# Altium schematic sheet ANYA_2620_V1_I1.SchDoc
size A2; SheetNumber: 1; SheetTotal: 2
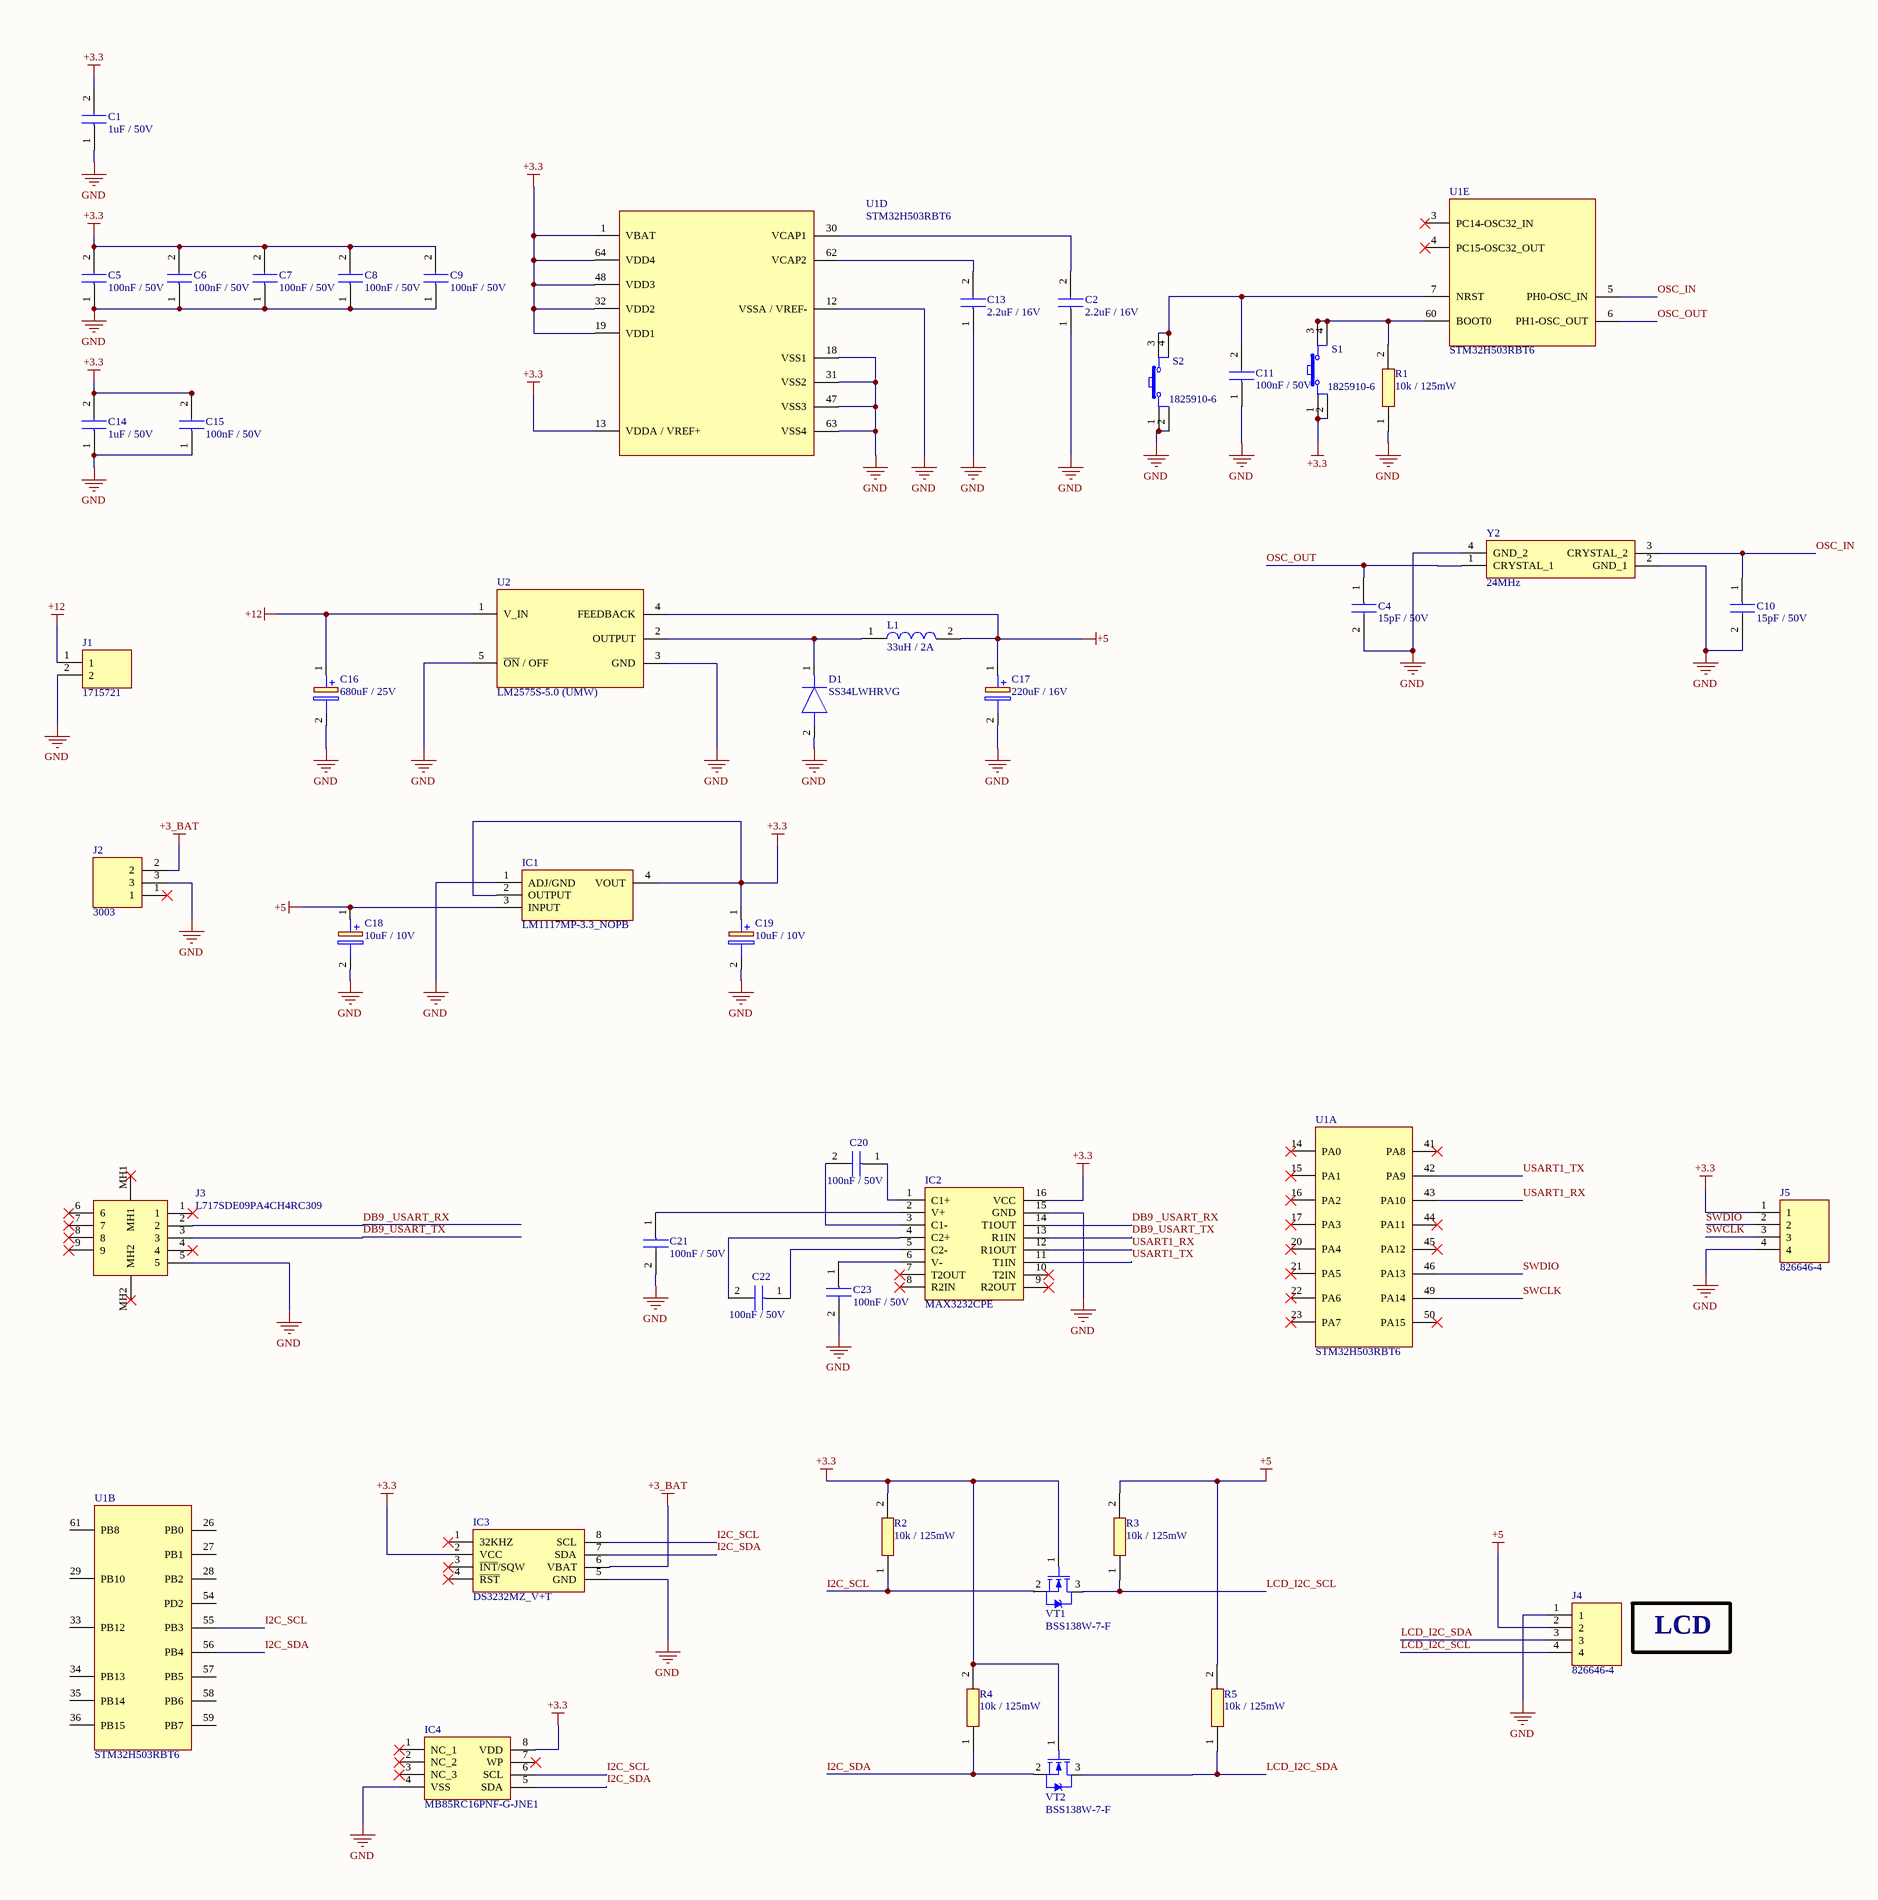
[diagram p0: ANYA_2620_V1_I1.SchDoc, left]
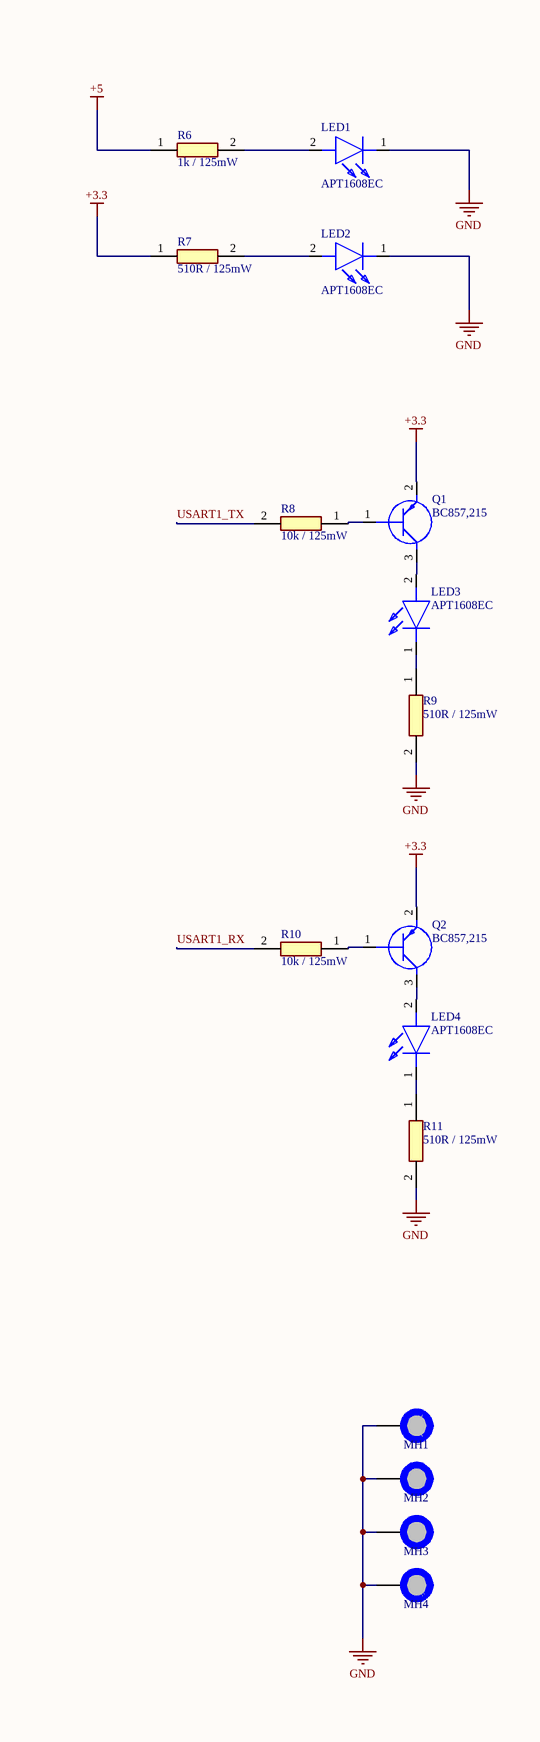
[diagram p1: ANYA_2620_V1_I1.SchDoc, right]

## Parts
C1  1uF / 50V  [CAPC2012X145N]
C2  2.2uF / 16V  [CAPC2012X145N]
C4  15pF / 50V  [CAPC2012X75N]
C5  100nF / 50V  [CAPC2012X95N]
C6  100nF / 50V  [CAPC2012X95N]
C7  100nF / 50V  [CAPC2012X95N]
C8  100nF / 50V  [CAPC2012X95N]
C9  100nF / 50V  [CAPC2012X95N]
C10  15pF / 50V  [CAPC2012X75N]
C11  100nF / 50V  [CAPC2012X95N]
C13  2.2uF / 16V  [CAPC2012X145N]
C14  1uF / 50V  [CAPC2012X145N]
C15  100nF / 50V  [CAPC2012X95N]
C16  680uF / 25V  [CAPPRD500W65D1000H1750]
C17  220uF / 16V  [EEEFK0J331AL]
C18  10uF / 10V  [T491A]
C19  10uF / 10V  [T491A]
C20  100nF / 50V  [CAPC2012X95N]
C21  100nF / 50V  [CAPC2012X95N]
C22  100nF / 50V  [CAPC2012X95N]
C23  100nF / 50V  [CAPC2012X95N]
D1  SS34LWHRVG  [SODFL3718X102N]
D2  LCD  [LCD]  (value not drawn)
IC1  LM1117MP-3.3_NOPB  [SOT230P700X180-4N]
IC2  MAX3232CPE  [DIP794W56P254L1918H457Q16N]
IC3  DS3232MZ_V+T  [SOIC127P600X175-8N]
IC4  MB85RC16PNF-G-JNE1  [SOIC127P600X175-8N]
J1  1715721  [1715721]
J2  3003  [3003]
J3  L717SDE09PA4CH4RC309  [L717SDE09PA4CH4RC309]
J4  826646-4  [HDRV4W68P0X254_1X4_1016X250X880P]
J5  826646-4  [HDRV4W68P0X254_1X4_1016X250X880P]
L1  33uH / 2A  [RLB0912330KL]
LED1  APT1608EC  [LEDC1608X85N]
LED2  APT1608EC  [LEDC1608X85N]
LED3  APT1608EC  [LEDC1608X85N]
LED4  APT1608EC  [LEDC1608X85N]
MH1  MH_7.4MMNC_3.2MMD  [MH_7.4MMD_3.2MMD_NON_COPPER_NPTH]  (value not drawn)  (no BOM)
MH2  MH_7.4MMC_3.2MMD  [MH_7.4MMD_3.2MMD]  (value not drawn)  (no BOM)
MH3  MH_7.4MMC_3.2MMD  [MH_7.4MMD_3.2MMD]  (value not drawn)  (no BOM)
MH4  MH_7.4MMC_3.2MMD  [MH_7.4MMD_3.2MMD]  (value not drawn)  (no BOM)
Q1  BC857,215  [BC857215]
Q2  BC857,215  [BC857215]
R1  10k / 125mW  [RESC2012X60N]
R2  10k / 125mW  [RESC2012X60N]
R3  10k / 125mW  [RESC2012X60N]
R4  10k / 125mW  [RESC2012X60N]
R5  10k / 125mW  [RESC2012X60N]
R6  1k / 125mW  [RESC2013X65N]
R7  510R / 125mW  [ERJ6ENF1000V]
R8  10k / 125mW  [RESC2012X60N]
R9  510R / 125mW  [ERJ6ENF1000V]
R10  10k / 125mW  [RESC2012X60N]
R11  510R / 125mW  [ERJ6ENF1000V]
S1  1825910-6  [TE_1825910-6]
S2  1825910-6  [TE_1825910-6]
U1  STM32H503RBT6  [QFP64P50_1200X1200X160L60X22N]  (parts A,B,D,E of 5)
U2  LM2575S-5.0 (UMW)  [DPAK6P170_1534X467L254X81T736X1018N]
VT1  BSS138W-7-F  [SOT23-3P65_222X100L35X30N]
VT2  BSS138W-7-F  [SOT23-3P65_222X100L35X30N]
Y2  24MHz  [7M24000MEEQT]

## Nets
+3.3: C1.2 C5.2 C6.2 C7.2 C8.2 C9.2 C14.2 C15.2 C19.1(+) IC1.2(OUTPUT) IC1.4(VOUT) IC2.16(VCC) IC3.2(VCC) IC4.8(VDD) J5.1 Q1.2(E) Q2.2(E) R2.2 R4.2 R7.1 S1.1 S1.2 U1.1(VBAT) U1.13(VDDA_/_VREF+) U1.19(VDD1) U1.32(VDD2) U1.48(VDD3) U1.64(VDD4) VT1.1(G) VT2.1(G)
+3_BAT: IC3.6(VBAT) J2.2
+5: C17.1(+) C18.1(+) IC1.3(INPUT) J4.2 L1.2 R3.2 R5.2 R6.1 U2.4(FEEDBACK)
+12: C16.1(+) J1.1 U2.1(V_IN)
GND: C1.1 C2.1 C4.2 C5.1 C6.1 C7.1 C8.1 C9.1 C10.2 C11.1 C13.1 C14.1 C15.1 C16.2(-) C17.2(-) C18.2(-) C19.2(-) C21.2 C23.2 D1.2(A) IC1.1(ADJ/GND) IC2.15(GND) IC3.5(GND) IC4.4(VSS) J1.2 J2.3 J3.5 J4.1 J5.4 LED1.1(K) LED2.1(K) MH1.1 MH2.1 MH3.1 MH4.1 R1.1 R9.2 R11.2 S2.1 S2.2 U1.12(VSSA_/_VREF-) U1.18(VSS1) U1.31(VSS2) U1.47(VSS3) U1.63(VSS4) U2.3(GND) U2.5(~{ON}_/_OFF) Y2.2(GND_1) Y2.4(GND_2)
DB9 _USART_RX: IC2.14(T1OUT) J3.2
DB9_USART_TX: IC2.13(R1IN) J3.3
I2C_SCL: IC3.8(SCL) IC4.6(SCL) R2.1 U1.55(PB3) VT1.2(S)
I2C_SDA: IC3.7(SDA) IC4.5(SDA) R4.1 U1.56(PB4) VT2.2(S)
LCD_I2C_SCL: J4.4 R3.1 VT1.3(D)
LCD_I2C_SDA: J4.3 R5.1 VT2.3(D)
OSC_IN: C10.1 U1.5(PH0-OSC_IN) Y2.3(CRYSTAL_2)
OSC_OUT: C4.1 U1.6(PH1-OSC_OUT) Y2.1(CRYSTAL_1)
SWCLK: J5.3 U1.49(PA14)
SWDIO: J5.2 U1.46(PA13)
USART1_RX: IC2.12(R1OUT) R10.2 U1.43(PA10)
USART1_TX: IC2.11(T1IN) R8.2 U1.42(PA9)
NetC2_2: C2.2 U1.30(VCAP1)
NetC11_2: C11.2 S2.3 S2.4 U1.7(NRST)
NetC13_2: C13.2 U1.62(VCAP2)
NetC20_1: C20.1 IC2.1(C1+)
NetC20_2: C20.2 IC2.3(C1-)
NetC21_1: C21.1 IC2.2(V+)
NetC22_1: C22.1 IC2.5(C2-)
NetC22_2: C22.2 IC2.4(C2+)
NetC23_1: C23.1 IC2.6(V-)
NetD1_1: D1.1(K) L1.1 U2.2(OUTPUT)
NetLED1_2: LED1.2(A) R6.2
NetLED2_2: LED2.2(A) R7.2
NetLED3_1: LED3.1(K) R9.1
NetLED3_2: LED3.2(A) Q1.3(C)
NetLED4_1: LED4.1(K) R11.1
NetLED4_2: LED4.2(A) Q2.3(C)
NetQ1_1: Q1.1(B) R8.1
NetQ2_1: Q2.1(B) R10.1
NetR1_2: R1.2 S1.3 S1.4 U1.60(BOOT0)

Not connected (* = marked no-connect by the designer): IC2 7(T2OUT)* 8(R2IN)* 9(R2OUT)* 10(T2IN)*; IC3 1(32KHZ)* 3(~{INT}/SQW)* 4(~{RST})*; IC4 1(NC_1)* 2(NC_2)* 3(NC_3)* 7(WP)*; J2 1*; J3 1* 4* 6* 7* 8* 9* MH1* MH2*; U1 3(PC14-OSC32_IN)* 4(PC15-OSC32_OUT)* 14(PA0)* 15(PA1)* 16(PA2)* 17(PA3)* 20(PA4)* 21(PA5)* 22(PA6)* 23(PA7)* 26(PB0) 27(PB1) 28(PB2) 29(PB10) 33(PB12) 34(PB13) 35(PB14) 36(PB15) 41(PA8)* 44(PA11)* 45(PA12)* 50(PA15)* 54(PD2) 57(PB5) 58(PB6) 59(PB7) 61(PB8)

## Library data of the parts
C1 C14 = GRM21BR71H105KA12L: Capacitor; Manufacturer_Name: Murata Electronics; Datasheet Link: https://search.murata.co.jp/Ceramy/image/img/A01X/G101/ENG/GRM21BR71H105KA12-01.pdf; Height: 1.45mm; Manufacturer_Part_Number: GRM21BR71H105KA12L; Mouser Part Number: 81-GRM21BR71H105KA2L; Mouser Price/Stock: https://www.mouser.co.uk/ProductDetail/Murata-Electronics/GRM21BR71H105KA12L?qs=Er06SXQpt%252B60EIT%2FJ7%2F41Q%3D%3D; Arrow Part Number: GRM21BR71H105KA12L; Arrow Price/Stock: https://www.arrow.com/en/products/grm21br71h105ka12l/murata-manufacturing?utm_currency=USD&region=europe
C2 C13 = GRM21BR71C225KA12L: Capacitor; Manufacturer_Name: Murata Electronics; Datasheet Link: https://search.murata.co.jp/Ceramy/image/img/A01X/G101/ENG/GRM21BR71C225KA12-01A.pdf; Height: 1.45mm; Manufacturer_Part_Number: GRM21BR71C225KA12L; Mouser Part Number: 81-GRM21BR71C225KA2L; Mouser Price/Stock: https://www.mouser.co.uk/ProductDetail/Murata-Electronics/GRM21BR71C225KA12L?qs=vS1sKHMaE9W1mbhDq4LJMA%3D%3D; Arrow Part Number: GRM21BR71C225KA12L; Arrow Price/Stock: https://www.arrow.com/en/products/grm21br71c225ka12l/murata-manufacturing?region=nac
C4 C10 = CL21C150JBANNNC: Capacitor; Manufacturer_Name: SAMSUNG; Datasheet Link: https://datasheet.datasheetarchive.com/originals/distributors/Datasheets_SAMA/65161877d8c1b6ca942dd697d2ecf8eb.pdf; Height: 0.75mm; Manufacturer_Part_Number: CL21C150JBANNNC
C5-C9 C11 C15 C20-C23 = CL21B104KBCNNNC: Capacitor; Manufacturer_Name: SAMSUNG; Datasheet Link: https://datasheet.datasheetarchive.com/originals/distributors/Datasheets_SAMA/86a3eaf0882763ef32124d5901f9b833.pdf; Height: 0.95mm; Manufacturer_Part_Number: CL21B104KBCNNNC; Mouser Part Number: 187-CL21B104KBCNNNC; Mouser Price/Stock: https://www.mouser.co.uk/ProductDetail/Samsung-Electro-Mechanics/CL21B104KBCNNNC?qs=349EhDEZ59pEfpnm5yBEmQ%3D%3D; Arrow Part Number: CL21B104KBCNNNC; Arrow Price/Stock: https://www.arrow.com/en/products/cl21b104kbcnnnc/samsung-electro-mechanics?utm_currency=USD&region=nac
C16 = EEU-FP1E681B: Capacitor Polarised; Manufacturer_Name: Panasonic; Datasheet Link: http://industrial.panasonic.com/cdbs/www-data/pdf/RDF0000/RDF0000C1260.pdf; Height: 17.5mm; Manufacturer_Part_Number: EEU-FP1E681B; Mouser Part Number: 667-EEU-FP1E681B; Mouser Price/Stock: https://www.mouser.co.uk/ProductDetail/Panasonic/EEU-FP1E681B?qs=w%2Fv1CP2dgqpgTnW5K8vWfA%3D%3D; Arrow Part Number: EEU-FP1E681B; Arrow Price/Stock: https://www.arrow.com/en/products/eeu-fp1e681b/panasonic
C17 = EEE-FP1C221AL: Capacitor Polarised; Manufacturer_Name: Panasonic; Datasheet Link: http://industrial.panasonic.com/cdbs/www-data/pdf/RDE0000/RDE0000C1272.pdf; Height: 6.5mm; Manufacturer_Part_Number: EEE-FP1C221AL
C18 C19 = T491A106K010AT: Capacitor Polarised; Manufacturer_Name: Yageo Group; Datasheet Link: https://www.yageogroup.com/content/datasheet/asset/file/KEM_T2005_T491; Height: 1.8mm; Manufacturer_Part_Number: T491A106K010AT; Mouser Part Number: 80-T491A106K010; Mouser Price/Stock: https://www.mouser.co.uk/ProductDetail/KEMET/T491A106K010AT?qs=VCf6WUQjPgE2CESwzh%252BRVg%3D%3D; Arrow Part Number: T491A106K010AT; Arrow Price/Stock: https://www.arrow.com/en/products/t491a106k010at/kemet-corporation?utm_currency=USD&region=nac
D1 = SS34LWHRVG: Diode; Manufacturer_Name: Taiwan Semiconductor; Datasheet Link: https://datasheet.datasheetarchive.com/originals/distributors/DKDS-20/389381.pdf; Height: 1.02mm; Manufacturer_Part_Number: SS34LWHRVG; Mouser Part Number: 821-SS34LWHRVG; Mouser Price/Stock: https://www.mouser.co.uk/ProductDetail/Taiwan-Semiconductor/SS34LWHRVG?qs=5aG0NVq1C4zYvYQjFNyRbA%3D%3D; Arrow Part Number: SS34LWHRVG; Arrow Price/Stock: https://www.arrow.com/en/products/ss34lwhrvg/taiwan-semiconductor?region=asia
IC1 = LM1117MP-3.3_NOPB: Integrated Circuit; Manufacturer_Name: Texas Instruments; Manufacturer_Part_Number: LM1117MP-3.3/NOPB; Datasheet Link: http://www.ti.com/general/docs/suppproductinfo.tsp?distId=10&gotoUrl=http%3A%2F%2Fwww.ti.com%2Flit%2Fgpn%2Flm1117; Height: 1.8mm; Mouser Part Number: 926-LM1117MP-3.3NOPB; Mouser Price/Stock: https://www.mouser.co.uk/ProductDetail/Texas-Instruments/LM1117MP-3.3-NOPB?qs=X1J7HmVL2ZFn4x9DZ4T2hA%3D%3D; Arrow Part Number: LM1117MP-3.3/NOPB; Arrow Price/Stock: https://www.arrow.com/en/products/lm1117mp-3-3nopb/texas-instruments.html?utm_currency=USD&region=nac
IC2 = MAX3232CPE: Integrated Circuit; Manufacturer_Name: Analog Devices; Datasheet Link: https://eu.mouser.com/datasheet/2/256/MAX3222-MAX3241-1292123.pdf; Height: 4.572mm; Manufacturer_Part_Number: MAX3232CPE; Mouser Part Number: N/A; Mouser Price/Stock: https://www.mouser.co.uk/ProductDetail/Maxim-Integrated/MAX3232CPE?qs=OjdDRS8jtCZlH34X6oTfKg%3D%3D
IC3 = DS3232MZ_V+T: Integrated Circuit; Manufacturer_Name: Analog Devices; Manufacturer_Part_Number: DS3232MZ/V+T; Datasheet Link: https://www.maximintegrated.com/en/products/analog/real-time-clocks/DS3232M.html/product-details/tabs-2#modalDatasheet; Height: 1.75mm; Mouser Part Number: 700-DS3232MZ/V+T; Mouser Price/Stock: https://www.mouser.co.uk/ProductDetail/Maxim-Integrated/DS3232MZ-V%2bT?qs=CEvMt6SrWlKJOC%2F9yxJOLQ%3D%3D; Arrow Part Number: DS3232MZ/V+T; Arrow Price/Stock: null?utm_currency=USD&region=nac
IC4 = MB85RC16PNF-G-JNE1: Integrated Circuit; Manufacturer_Name: Ramxeed; Datasheet Link: https://componentsearchengine.com/Datasheets/2/MB85RC16PNF-G-JNE1.pdf; Height: 1.75mm; Manufacturer_Part_Number: MB85RC16PNF-G-JNE1; Mouser Part Number: N/A; Mouser Price/Stock: https://www.mouser.co.uk/ProductDetail/Fujitsu/MB85RC16PNF-G-JNE1?qs=TiOZkKH1s2TCV9lc7rqJ4g%3D%3D
J1 = 1715721: Connector; Manufacturer_Name: Phoenix Contact; Datasheet Link: https://www.phoenixcontact.com/en-us/products/printed-circuit-board-terminal-mkds-15-2-508-1715721?type=pdf; Height: 13.95mm; Manufacturer_Part_Number: 1715721; Mouser Part Number: 651-1715721; Mouser Price/Stock: https://www.mouser.co.uk/ProductDetail/Phoenix-Contact/1715721?qs=BYlwlsDsB%2FqgmKyTCSucHg%3D%3D; Arrow Part Number: 1715721; Arrow Price/Stock: https://www.arrow.com/en/products/1715721/phoenix-contact?utm_currency=USD&region=nac
J2 = 3003: Connector; Manufacturer_Name: Keystone Electronics; Datasheet Link: https://datasheet.datasheetarchive.com/originals/distributors/Datasheets-DGA1/157503.pdf; Height: 3.3mm; Manufacturer_Part_Number: 3003; Mouser Part Number: 534-3003; Mouser Price/Stock: https://www.mouser.co.uk/ProductDetail/Keystone-Electronics/3003?qs=Mn60vILZNNaTqSonuV33Fw%3D%3D; Arrow Part Number: 3003; Arrow Price/Stock: https://www.arrow.com/en/products/3003/keystone-electronics?region=europe
J3 = L717SDE09PA4CH4RC309: Connector; Manufacturer_Name: Amphenol Communications Solutions; Datasheet Link: https://cdn.amphenol-cs.com/media/wysiwyg/files/drawing/l717sdxxxpa4ch4rc309.pdf; Height: 12.3mm; Manufacturer_Part_Number: L717SDE09PA4CH4RC309; Mouser Part Number: 523-L7SDE9PA4CH4RC39; Mouser Price/Stock: https://www.mouser.co.uk/ProductDetail/Amphenol-Commercial-Products/L717SDE09PA4CH4RC309?qs=wLKqLMNa9uJwTJVotSU7Wg%3D%3D; Arrow Part Number: L717SDE09PA4CH4RC309; Arrow Price/Stock: https://www.arrow.com/en/products/l717sde09pa4ch4rc309/amphenol-fci?region=nac
J4 J5 = 826646-4: Connector; Manufacturer_Name: TE Connectivity; Datasheet Link: https://www.te.com/commerce/DocumentDelivery/DDEController?Action=srchrtrv&DocNm=826629&DocType=Customer+Drawing&DocLang=English&DocFormat=pdf&PartCntxt=826646-4; Height: 8.8mm; Manufacturer_Part_Number: 826646-4; Mouser Part Number: 571-826646-4; Mouser Price/Stock: https://www.mouser.co.uk/ProductDetail/TE-Connectivity/826646-4?qs=iFS2b0%2FgCMG%2Fr%252BKRBAlOvw%3D%3D; Arrow Part Number: 826646-4; Arrow Price/Stock: https://www.arrow.com/en/products/826646-4/te-connectivity?utm_currency=USD&region=europe
L1 = RLB0912-330KL: Inductor; Manufacturer_Name: Bourns; Datasheet Link: https://www.bourns.com/docs/Product-Datasheets/rlb.pdf; Height: 11mm; Manufacturer_Part_Number: RLB0912-330KL; Mouser Part Number: 652-RLB0912-330KL; Mouser Price/Stock: https://www.mouser.co.uk/ProductDetail/Bourns/RLB0912-330KL?qs=AC4ivEYFOTADPKm07IwpKA%3D%3D; Arrow Part Number: RLB0912-330KL; Arrow Price/Stock: https://www.arrow.com/en/products/rlb0912-330kl/bourns?utm_currency=USD&region=nac
LED1-LED4 = APT1608EC: LED; Manufacturer_Name: Kingbright; Datasheet Link: https://datasheet.datasheetarchive.com/originals/distributors/Datasheets-16/DSA-306624.pdf; Height: 0.85mm; Manufacturer_Part_Number: APT1608EC; Mouser Part Number: 604-APT1608EC; Mouser Price/Stock: https://www.mouser.co.uk/ProductDetail/Kingbright/APT1608EC?qs=y3UkhjaxUTbvcINjaB1ATQ%3D%3D; Arrow Part Number: APT1608EC; Arrow Price/Stock: https://www.arrow.com/en/products/apt1608ec/kingbright?utm_currency=USD&region=nac
MH1 = MH_7.4MMNC_3.2MMD: Mounting Hole 7.4mm Diameter (Non Copper), 3.2mm Drill
MH2-MH4 = MH_7.4MMC_3.2MMD: Mounting Hole 7.4mm Diameter, 3.2mm Drill
Q1 Q2 = BC857,215: Transistor BJT PNP; Manufacturer_Name: Nexperia; Datasheet Link: https://assets.nexperia.com/documents/data-sheet/BC856_BC857_BC858.pdf; Height: 1.1mm; Manufacturer_Part_Number: BC857,215; Mouser Part Number: 771-BC857215; Mouser Price/Stock: https://www.mouser.co.uk/ProductDetail/Nexperia/BC857215?qs=me8TqzrmIYWtuVsCNoXfHg%3D%3D; Arrow Part Number: BC857,215; Arrow Price/Stock: https://www.arrow.com/en/products/bc857215/nexperia?utm_currency=USD&region=europe
R1-R5 R8 R10 = RC0805FR-0710KL: Resistor; Manufacturer_Name: Yageo Group; Datasheet Link: https://www.yageo.com/upload/media/product/productsearch/datasheet/rchip/PYu-RC_Group_51_RoHS_L_11.pdf; Height: 0.6mm; Manufacturer_Part_Number: RC0805FR-0710KL; Mouser Part Number: 603-RC0805FR-0710KL; Mouser Price/Stock: https://www.mouser.co.uk/ProductDetail/YAGEO/RC0805FR-0710KL?qs=7bY8808IzHq6vrU3BeiiYw%3D%3D; Arrow Part Number: RC0805FR-0710KL; Arrow Price/Stock: https://www.arrow.com/en/products/rc0805fr0710kl/yageo.html?utm_currency=USD&region=europe
R6 = 0805W8F1001T5E: Resistor; Manufacturer_Name: ROYALOHM; Datasheet Link: https://www.mouser.de/datasheet/2/1365/1-3044649.pdf; Height: 0.65mm; Manufacturer_Part_Number: 0805W8F1001T5E; Mouser Part Number: 303-0805W8F1001T5E; Mouser Price/Stock: https://www.mouser.co.uk/ProductDetail/Royalohm/0805W8F1001T5E?qs=e8oIoAS2J1RgTTQhbYTt7g%3D%3D
R7 R9 R11 = ERJ-6ENF5100V: Resistor; Manufacturer_Name: Panasonic; Datasheet Link: https://industrial.panasonic.com/cdbs/www-data/pdf/RDA0000/AOA0000C84.pdf; Height: 0.7mm; Manufacturer_Part_Number: ERJ-6ENF5100V; Mouser Part Number: 667-ERJ-6ENF5100V; Mouser Price/Stock: https://www.mouser.co.uk/ProductDetail/Panasonic/ERJ-6ENF5100V?qs=50QC8w71jAsaos0hOIX1VA%3D%3D
S1 S2 = 1825910-6: Switch Tactile OFF (ON) SPST Round Button PC Pins 0.05A 24VDC 1.57N Thru-Hole Loose; Manufacturer: TE Connectivity; Manufacturer Lifecycle Status: ACTIVE; Actuator Length: 1.397mm; Actuator Material: PBT, Polyacetal, Resin; Contact Current Rating: 50mA; Contact Resistance: 100mΩ; Electrical Life: 100kcycles; Illumination Type: Illuminated, Non-Illuminated; Max Voltage Rating (DC): 24V; Number of Positions: 1; Operating Force: 1.568N; Switch Function: Off-Mom; Switch Travel: 250µm; Height: 3.61mm; Supplier: LCSC; Supplier Part Number: C428628; Manufacturer Part Number: 1825910-6; RoHS: Compliant; Category: Pushbutton Switches; Stock: 15605; Pricing: 5=0.1374, 50=0.1164, 150=0.1059, 750=0.094, 2250=0.0877, 5250=0.0845 (USD); China RoHS: Compliant; Color: Black; Contact Material: Copper; Contact Plating: Silver; Current Rating: 50mA; Export Control Classification Number (ECCN) Code: EAR99; ELV: Compliant; Housing Material: Nylon; Harmonized Tariff Schedule (HTS) Code: 8536.50.90.40; Insulation Resistance: 100MΩ; Introduction Date: 2010-05-28; Lead Free: Lead Free; Length: 5.99mm; Life (Cycles): 100kcycles; Lifecycle Status: Production; Material: Nylon; Max Current Rating: 50mA; Max Operating Temperature: 85°C; Mechanical Life: 100kcycles; Min Operating Temperature: -35°C; Mounting Technology: Through Hole; Orientation: Straight; Packaging: Bulk; REACH SVHC: Yes; Termination: PC Pin, PC Pins; Throw Configuration: SPST; Type: Switch; Voltage Rating (DC): 24V; Width: 6mm; ComponentLink1URL: https://datasheet.octopart.com:443/1825910-6-TE-Connectivity-datasheet-10294628.pdf?src-supplier=HQonline; ComponentLink1Description: https://datasheet.octopart.com:443/1825910-6-TE-Connectivity-datasheet-10294628.pdf?src-supplier=HQonline; ComponentLink2URL: https://datasheet.octopart.com:443/1825910-6-TE-Connectivity-datasheet-179971975.pdf?src-supplier=IHS; ComponentLink2Description: https://datasheet.octopart.com:443/1825910-6-TE-Connectivity-datasheet-179971975.pdf?src-supplier=IHS; ComponentLink3URL: https://datasheet.octopart.com:443/FSM4JH-TE-Connectivity---AMP-datasheet-512274.pdf?src-supplier=IHS; ComponentLink3Description: https://datasheet.octopart.com:443/FSM4JH-TE-Connectivity---AMP-datasheet-512274.pdf?src-supplier=IHS; ComponentLink4URL: https://datasheet.octopart.com:443/1825910-6-TE-Connectivity---Alcoswitch-datasheet-181441334.pdf?src-supplier=IHS; ComponentLink4Description: https://datasheet.octopart.com:443/1825910-6-TE-Connectivity---Alcoswitch-datasheet-181441334.pdf?src-supplier=IHS; ComponentLink5URL: https://datasheet.octopart.com:443/FSM4JH-TE-Connectivity-datasheet-181317608.pdf?src-supplier=IHS; ComponentLink5Description: https://datasheet.octopart.com:443/FSM4JH-TE-Connectivity-datasheet-181317608.pdf?src-supplier=IHS; ComponentLink6URL: https://sigma.octopart.com:443/101748000/technical_drawing/TE-Connectivity-1825910-6.pdf?src-supplier=Sager+Electronics; ComponentLink6Description: https://sigma.octopart.com:443/101748000/technical_drawing/TE-Connectivity-1825910-6.pdf?src-supplier=Sager+Electronics; ComponentLink7URL: https://sigma.octopart.com:443/12291753/technical_drawing/TE-Connectivity-1825910-6.pdf?src-supplier=Burklin+Elektronik; ComponentLink7Description: https://sigma.octopart.com:443/12291753/technical_drawing/TE-Connectivity-1825910-6.pdf?src-supplier=Burklin+Elektronik; ComponentLink8URL: https://datasheet.octopart.com:443/FSM4JH-Tyco-Electronics-datasheet-5302851.pdf?src-supplier=Upverter; ComponentLink8Description: https://datasheet.octopart.com:443/FSM4JH-Tyco-Electronics-datasheet-5302851.pdf?src-supplier=Upverter; ComponentLink9URL: https://sigma.octopart.com:443/58177301/technical_drawing/TE-Connectivity-1825910-6.pdf?src-supplier=TE+Connectivity; ComponentLink9Description: https://sigma.octopart.com:443/58177301/technical_drawing/TE-Connectivity-1825910-6.pdf?src-supplier=TE+Connectivity; ComponentLink10URL: https://datasheet.octopart.com:443/1825910-6-TE-Connectivity-datasheet-33021037.pdf?src-supplier=Farnell; ComponentLink10Description: https://datasheet.octopart.com:443/1825910-6-TE-Connectivity-datasheet-33021037.pdf?src-supplier=Farnell; ComponentLink11URL: https://datasheet.octopart.com:443/FSM4JH-Tyco-Electronics-datasheet-12163206.pdf?src-supplier=Farnell; ComponentLink11Description: https://datasheet.octopart.com:443/FSM4JH-Tyco-Electronics-datasheet-12163206.pdf?src-supplier=Farnell; ComponentLink12URL: https://datasheet.octopart.com:443/FSM4JH-Alcoswitch-datasheet-41434433.pdf?src-supplier=Master+Electronics; ComponentLink12Description: https://datasheet.octopart.com:443/FSM4JH-Alcoswitch-datasheet-41434433.pdf?src-supplier=Master+Electronics; ComponentLink13URL: https://datasheet.octopart.com:443/1825910-6-TE-Connectivity---AMP-datasheet-189108451.pdf?src-supplier=Master+Electronics; ComponentLink13Description: https://datasheet.octopart.com:443/1825910-6-TE-Connectivity---AMP-datasheet-189108451.pdf?src-supplier=Master+Electronics; ComponentLink14URL: https://datasheet.octopart.com:443/1825910-6-TE-Connectivity-datasheet-145419878.pdf?src-supplier=RS+(Formerly+Allied+Electronics); ComponentLink14Description: https://datasheet.octopart.com:443/1825910-6-TE-Connectivity-datasheet-145419878.pdf?src-supplier=RS+(Formerly+Allied+Electronics); ComponentLink15URL: https://datasheet.octopart.com:443/FSM4JH-Agastat-datasheet-15984561.pdf?src-supplier=RS+(Formerly+Allied+Electronics); ComponentLink15Description: https://datasheet.octopart.com:443/FSM4JH-Agastat-datasheet-15984561.pdf?src-supplier=RS+(Formerly+Allied+Electronics); ComponentLink16URL: https://datasheet.octopart.com:443/1825910-6-TE-Connectivity-datasheet-140613545.pdf?src-supplier=TME; ComponentLink16Description: https://datasheet.octopart.com:443/1825910-6-TE-Connectivity-datasheet-140613545.pdf?src-supplier=TME; ComponentLink17URL: https://datasheet.octopart.com:443/1825910-6-TE-Connectivity---AMP-datasheet-23715110.pdf?src-supplier=Electro+Sonic; ComponentLink17Description: https://datasheet.octopart.com:443/1825910-6-TE-Connectivity---AMP-datasheet-23715110.pdf?src-supplier=Electro+Sonic; ComponentLink18URL: http://sigma.octopart.com:80/14574207/rohs_statement/TE-Connectivity-1825910-6.pdf?src-supplier=Compliance+Statements; ComponentLink18Description: http://sigma.octopart.com:80/14574207/rohs_statement/TE-Connectivity-1825910-6.pdf?src-supplier=Compliance+Statements; ComponentLink19URL: http://sigma.octopart.com:80/41598133/materials_sheet/TE-Connectivity-1825910-6.pdf?src-supplier=Compliance+Statements; ComponentLink19Description: http://sigma.octopart.com:80/41598133/materials_sheet/TE-Connectivity-1825910-6.pdf?src-supplier=Compliance+Statements; ComponentLink20URL: http://sigma.octopart.com:80/78006367/materials_sheet/TE-Connectivity-1825910-6.pdf?src-supplier=Compliance+Statements; ComponentLink20Description: http://sigma.octopart.com:80/78006367/materials_sheet/TE-Connectivity-1825910-6.pdf?src-supplier=Compliance+Statements; ComponentLink21URL: http://sigma.octopart.com:80/136693561/materials_sheet/TE-Connectivity-1825910-6.pdf?src-supplier=Compliance+Statements; ComponentLink21Description: http://sigma.octopart.com:80/136693561/materials_sheet/TE-Connectivity-1825910-6.pdf?src-supplier=Compliance+Statements; ComponentLink22URL: http://sigma.octopart.com:80/14555950/rohs_certificate/Agastat-FSM4JH.pdf?src-supplier=Compliance+Statements; ComponentLink22Description: http://sigma.octopart.com:80/14555950/rohs_certificate/Agastat-FSM4JH.pdf?src-supplier=Compliance+Statements
U1 = STM32H503RBT6: RISC Microcontroller, 32-Bit, FLASH, CORTEX-M4F CPU, 180MHz, CMOS, PBGA216; Manufacturer: STMicroelectronics; Supplier: LCSC; Supplier Part Number: C6807804; Manufacturer Part Number: STM32H503RBT6; RoHS: Compliant; Category: Microcontrollers; Stock: 883; Pricing: 1=3.5339, 10=3.0062, 30=2.6936, 160=2.3779, 480=2.2319, 960=2.1659 (USD); Country of Origin: Mainland China, Taiwan; Export Control Classification Number (ECCN) Code: 3A991.A.2; Harmonized Tariff Schedule (HTS) Code: 8542.31.00.30; Lifecycle Status: Production; REACH SVHC: Yes; ComponentLink1URL: https://datasheet.octopart.com:443/STM32H503RBT6-STMicroelectronics-datasheet-188928330.pdf?src-supplier=TME; ComponentLink1Description: https://datasheet.octopart.com:443/STM32H503RBT6-STMicroelectronics-datasheet-188928330.pdf?src-supplier=TME
U2 = LM2575S-5.0 (UMW): 52kHz Buck Fixed 2A 5V TO-263-5 Voltage Regulators - DC DC Switching Regulators RoHS; Manufacturer Lifecycle Status: ACTIVE; Efficiency: 77%; Max Supply Voltage: 40V; Max Output current: 1A; Min Input Voltage: 4V; Number of Channels: 1; Quiescent Current: 10mA; Switching Frequency: 58kHz; Synchronous Rectifier: No; Supplier: LCSC; Supplier Part Number: C347405; Manufacturer: UMW; Manufacturer Part Number: LM2575S-5.0(UMW); RoHS: Compliant; Category: Voltage Regulators - Switching; Stock: 1142; Pricing: 1=1.997, 10=1.709, 30=1.5282, 100=1.2674, 500=1.1826, 1000=1.1474 (USD); Case/Package: TO-263; Contact Plating: Tin; Height: 4.83mm; Length: 10.16mm; Lifecycle Status: Production; Max Operating Temperature: 125°C; Min Operating Temperature: -40°C; Mounting Technology: Surface Mount; Nominal Output Voltage: 5V; Number of Outputs: 1; Pins: 5; Operating Supply Voltage: 40V; Output Current: 1A; Output Type: Fixed; Output Voltage: 5V; Radiation Hardening: No; REACH SVHC: No; Schedule B: 8542390000, 8542390000|8542390000|8542390000|8542390000, 8542390000|8542390000|8542390000|8542390000|8542390000|8542390000|8542390000|8542390000|8542390000|8542390000|8542390000|8542390000|8542390000|8542390000|8542390000|8542390000|8542390000|8542390000|8542390000|8542390000|8542390000|8542390000|8542390000|85; Thickness: 4.58mm; Topology: Buck; Width: 8.42mm; ComponentLink1URL: https://www.lcsc.com/datasheet/C347405.pdf; ComponentLink1Description: https://www.lcsc.com/datasheet/C347405.pdf
VT1 VT2 = BSS138W-7-F: Transistor: N-MOSFET; unipolar; 50V; 0.2A; 3.5ohm; 0.2W; -55+150 deg.C; SMD; SOT323(SC70); Manufacturer: Diodes Inc.; Continuous Drain Current (ID): 200mA; Current: 2A; Drain to Source Breakdown Voltage: 75V; Drain to Source Resistance: 3.5Ω; Element Configuration: Single; Gate to Source Voltage (Vgs): 20V; Input Capacitance: 50pF; Max Power Dissipation: 200mW; Nominal Vgs: 1.2V; Number of Channels: 1; Turn-Off Delay Time: 20ns; Value: 3.5Ω; Supplier: LCSC; Supplier Part Number: C24553; Manufacturer Part Number: BSS138W-7-F; RoHS: Compliant; Category: MOSFETs; Stock: 14390; Pricing: 10=0.034, 10=0.039, 10=0.3113, 10=0.2851, 100=0.0313, 100=0.2498, 100=0.0273, 100=0.2288, 300=0.0239, 300=0.0274, 300=0.2003, 300=0.2187, 3000=0.0245, 3000=0.1791, 3000=0.1956, 3000=0.0214, 6000=0.0194, 6000=0.1623, 6000=0.0222, 6000=0.1772, 9000=0.0184, 9000=0.0211, 9000=0.1543, 9000=0.1684 (EUR); Case/Package: SOT-323; China RoHS: Compliant; Contact Plating: Tin; Current Rating: 200mA; Drain to Source Voltage (Vdss): 50V; Dual Supply Voltage: 50V; Height: 1mm; Lead Free: Lead Free; Length: 2.2mm; Lifecycle Status: Production; Max Operating Temperature: 150°C; Min Breakdown Voltage: 50V; Min Operating Temperature: -55°C; Mounting Technology: Surface Mount; Number of Elements: 1; Pins: 3; Number of Terminals: 3; Power Dissipation: 200mW; Rds On Max: 3.5Ω; REACH SVHC: Yes; Schedule B: 8541210080, 8541210080|8541210080|8541210080|8541210080|8541210080; Termination: SMD/SMT; Threshold Voltage: 1.2V; Turn-On Delay Time: 20ns; Voltage: 50V; Voltage Rating (DC): 50V; Weight: 6.010099mg; Width: 1.35mm; ComponentLink1URL: https://datasheet.octopart.com:443/BSS138W-7-F-Diodes-Inc.-datasheet-180551831.pdf?src-supplier=Newark; ComponentLink1Description: https://datasheet.octopart.com:443/BSS138W-7-F-Diodes-Inc.-datasheet-180551831.pdf?src-supplier=Newark; ComponentLink2URL: https://datasheet.octopart.com:443/BSS138W-7-F-Diodes-Inc.-datasheet-10330874.pdf?src-supplier=Newark; ComponentLink2Description: https://datasheet.octopart.com:443/BSS138W-7-F-Diodes-Inc.-datasheet-10330874.pdf?src-supplier=Newark; ComponentLink3URL: https://datasheet.octopart.com:443/BSS138W-7-F-Diodes-Inc.-datasheet-37113701.pdf?src-supplier=Newark; ComponentLink3Description: https://datasheet.octopart.com:443/BSS138W-7-F-Diodes-Inc.-datasheet-37113701.pdf?src-supplier=Newark; ComponentLink4URL: https://datasheet.octopart.com:443/BSS138W-7-F-Diodes-Inc.-datasheet-8424047.pdf?src-supplier=Newark; ComponentLink4Description: https://datasheet.octopart.com:443/BSS138W-7-F-Diodes-Inc.-datasheet-8424047.pdf?src-supplier=Newark; ComponentLink5URL: https://datasheet.octopart.com:443/BSS138W-7-F-Diodes-Inc.-datasheet-115885208.pdf?src-supplier=Diodes+Inc+SCT; ComponentLink5Description: https://datasheet.octopart.com:443/BSS138W-7-F-Diodes-Inc.-datasheet-115885208.pdf?src-supplier=Diodes+Inc+SCT; ComponentLink6URL: https://sigma.octopart.com:443/138896157/technical_drawing/Diodes-Inc.-BSS138W-7-F.pdf?src-supplier=Diodes+Inc+SCT; ComponentLink6Description: https://sigma.octopart.com:443/138896157/technical_drawing/Diodes-Inc.-BSS138W-7-F.pdf?src-supplier=Diodes+Inc+SCT; ComponentLink7URL: https://datasheet.octopart.com:443/BSS138W-7-F-Diodes-Inc.-datasheet-133631.pdf?src-supplier=Mouser; ComponentLink7Description: https://datasheet.octopart.com:443/BSS138W-7-F-Diodes-Inc.-datasheet-133631.pdf?src-supplier=Mouser; ComponentLink8URL: https://datasheet.octopart.com:443/BSS138W-7-F-Diodes-Inc.-datasheet-14061695.pdf?src-supplier=iiiC; ComponentLink8Description: https://datasheet.octopart.com:443/BSS138W-7-F-Diodes-Inc.-datasheet-14061695.pdf?src-supplier=iiiC; ComponentLink9URL: https://datasheet.octopart.com:443/BSS138W-7-F-Diodes-Inc.-datasheet-7840986.pdf?src-supplier=Jameco; ComponentLink9Description: https://datasheet.octopart.com:443/BSS138W-7-F-Diodes-Inc.-datasheet-7840986.pdf?src-supplier=Jameco; ComponentLink10URL: http://sigma.octopart.com:80/15540767/rohs_statement/Diodes-Inc.-BSS138W-7-F.pdf?src-supplier=Compliance+Statements; ComponentLink10Description: http://sigma.octopart.com:80/15540767/rohs_statement/Diodes-Inc.-BSS138W-7-F.pdf?src-supplier=Compliance+Statements; Supplier 1: LCSC; Supplier Part Number 1: C24553
Y2 = 7M-24.000MEEQ-T: Crystal or Oscillator; Manufacturer_Name: TXC CORPORATION; Datasheet Link: https://componentsearchengine.com/Datasheets/2/7M-24.000MEEQ-T.pdf; Height: 0.8mm; Manufacturer_Part_Number: 7M-24.000MEEQ-T; Mouser Part Number: 717-7M-24.000MEEQ-T; Mouser Price/Stock: https://www.mouser.co.uk/ProductDetail/TXC-Corporation/7M-24.000MEEQ-T?qs=65dIHZNch5uAabLkulpaow%3D%3D; Arrow Part Number: 7M-24.000MEEQ-T; Arrow Price/Stock: https://www.arrow.com/en/products/7m-24.000meeq-t/txc-corporation?utm_currency=USD&region=europe